# EAGLE design PortaCopos (EAGLE 9.6.2)

## Sheet 1 of 2
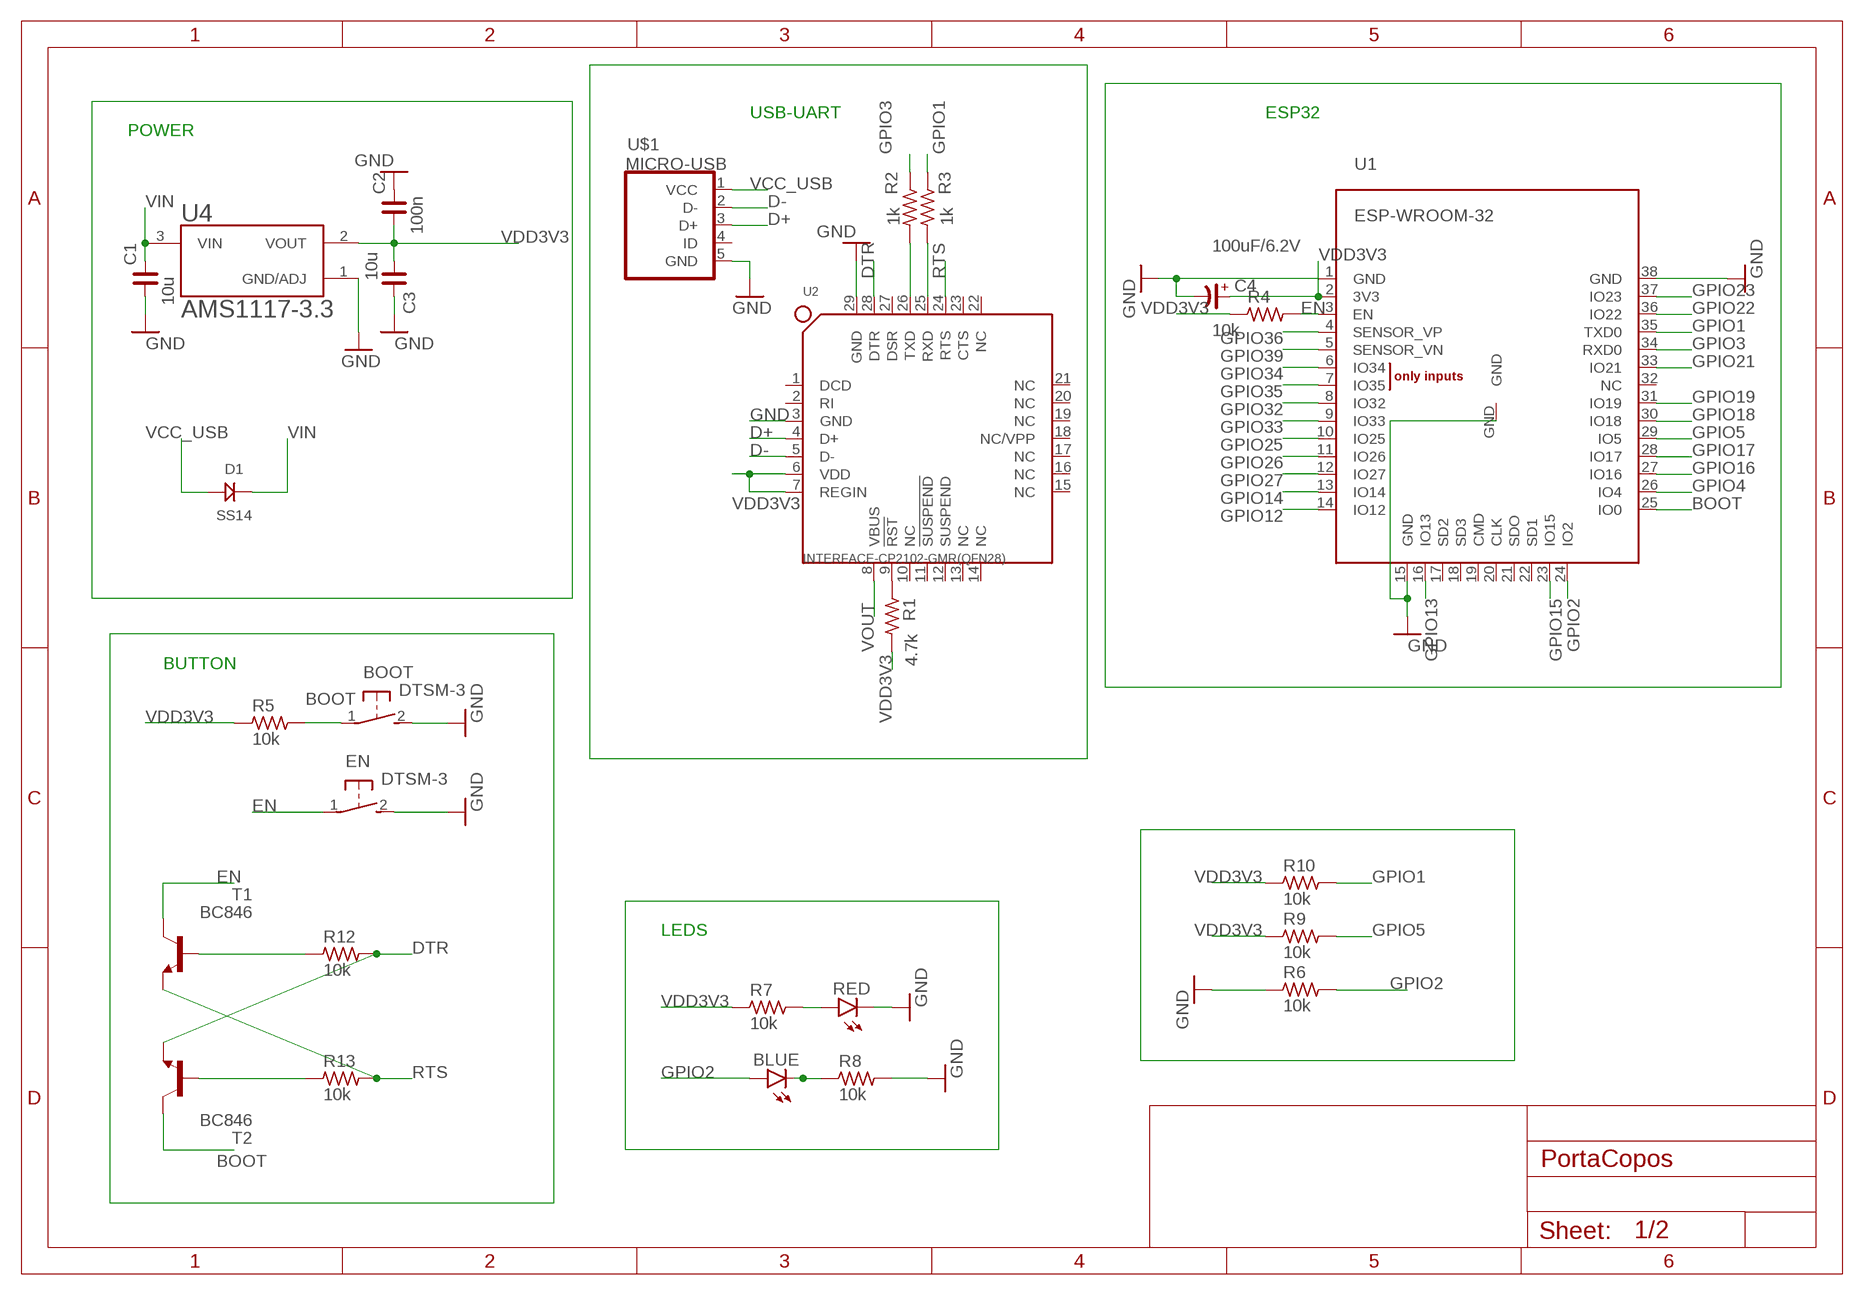
[diagram p0: schematic, sheet 1]

### Parts
BLUE  blue  LEDCHIPLED_0603  [CHIPLED_0603]
BOOT  DTSM-3  [DTSM-3]
C1  10u  C_0603  [C0603]
C2  100n  C_0603  [C0603]
C3  10u  C_0603  [C0603]
C4  100uF/6.2V  CP_3216-18  [C3216-18/T]
D1  SS14  [DO214]
EN  DTSM-3  [DTSM-3]
R1  4.7k  R_0603  [R0603]
R2  1k  R_0603  [R0603]
R3  1k  R_0603  [R0603]
R4  10k  R_0603  [R0603]
R5  10k  R_0603  [R0603]
R6  10k  R_0603  [R0603]
R7  10k  R_0603  [R0603]
R8  10k  R_0603  [R0603]
R9  10k  R_0603  [R0603]
R10  10k  R_0603  [R0603]
R12  10k  R_0603  [R0603]
R13  10k  R_0603  [R0603]
RED  red  LEDCHIPLED_0603  [CHIPLED_0603]
T1  BC846  [SOT23]
T2  BC846  [SOT23]
U1  ESP-WROOM-32  [ESP-WROOM-32]
U2  INTERFACE-CP2102-GMR(QFN28)  [QFN28G_0.5-5X5MM]
U4  AMS1117-3.3  [SOT229P700X180-4N]
U$1  MICRO-USB  [MICRO-USB-2]

### Nets
BOOT: BOOT.1 R5.2 T2.3(C) U1.25(IO0)
D+: U2.4(D+) U$1.3(D+)
D-: U2.5(D-) U$1.2(D-)
DTR: R12.2 T2.2(E) U2.28(DTR)
EN: EN.1 R4.2 T1.3(C) U1.3(EN)
GND: BOOT.2 C1.1 C2.2 C3.2 C4.- EN.2 R6.1 R8.2 RED.C U1.1(GND) U1.15(GND) U1.38(GND) U1.GND U2.3(GND) U2.29(GND) U4.1(GND/ADJ) U$1.5(GND) ; also sheet 2
GPIO1: R3.1 R10.2 U1.35(TXD0)
GPIO2: BLUE.A R6.2 U1.24(IO2)
GPIO3: R2.1 U1.34(RXD0)
GPIO4: U1.26(IO4) ; also sheet 2
GPIO5: R9.2 U1.29(IO5)
GPIO12: U1.14(IO12)
GPIO13: U1.16(IO13)
GPIO14: U1.13(IO14)
GPIO15: U1.23(IO15)
GPIO16: U1.27(IO16) ; also sheet 2
GPIO17: U1.28(IO17)
GPIO18: U1.30(IO18)
GPIO19: U1.31(IO19)
GPIO21: U1.33(IO21)
GPIO22: U1.36(IO22)
GPIO23: U1.37(IO23)
GPIO25: U1.10(IO25)
GPIO26: U1.11(IO26)
GPIO27: U1.12(IO27)
GPIO32: U1.8(IO32)
GPIO33: U1.9(IO33)
GPIO34: U1.6(IO34)
GPIO35: U1.7(IO35)
GPIO36: U1.4(SENSOR_VP)
GPIO39: U1.5(SENSOR_VN)
N$1: R1.1 U2.9(!RST)
N$2: R2.2 U2.26(TXD)
N$3: R3.2 U2.25(RXD)
N$5: R12.1 T1.1(B)
N$6: R13.1 T2.1(B)
N$7: BLUE.C R8.1
N$23: R7.2 RED.A
RTS: R13.2 T1.2(E) U2.24(RTS)
VCC_USB: D1.ANODE U$1.1(VCC)
VDD3V3: C2.1 C3.1 C4.+ R1.2 R4.1 R5.1 R7.1 R9.1 R10.1 U1.2(3V3) U2.6(VDD) U2.7(REGIN) U4.2(VOUT) ; also sheet 2
VIN: C1.2 D1.CATHODE(KATHODE) U4.3(VIN)
VOUT: U2.8(VBUS)
Unconnected: U1.17(SD2) U1.18(SD3) U1.19(CMD) U1.20(CLK) U1.21(SDO) U1.22(SD1) U1.32(NC) U2.1(DCD) U2.2(RI) U2.10(NC) U2.11(!SUSPEND) U2.12(SUSPEND) U2.13(NC) U2.14(NC) U2.15(NC) U2.16(NC) U2.17(NC) U2.18(NC/VPP) U2.19(NC) U2.20(NC) U2.21(NC) U2.22(NC) U2.23(CTS) U2.27(DSR) U$1.4(ID)

### Notes on the sheet
- USB-UART | ESP32
- POWER
- BUTTON
- LEDS

## Sheet 2 of 2
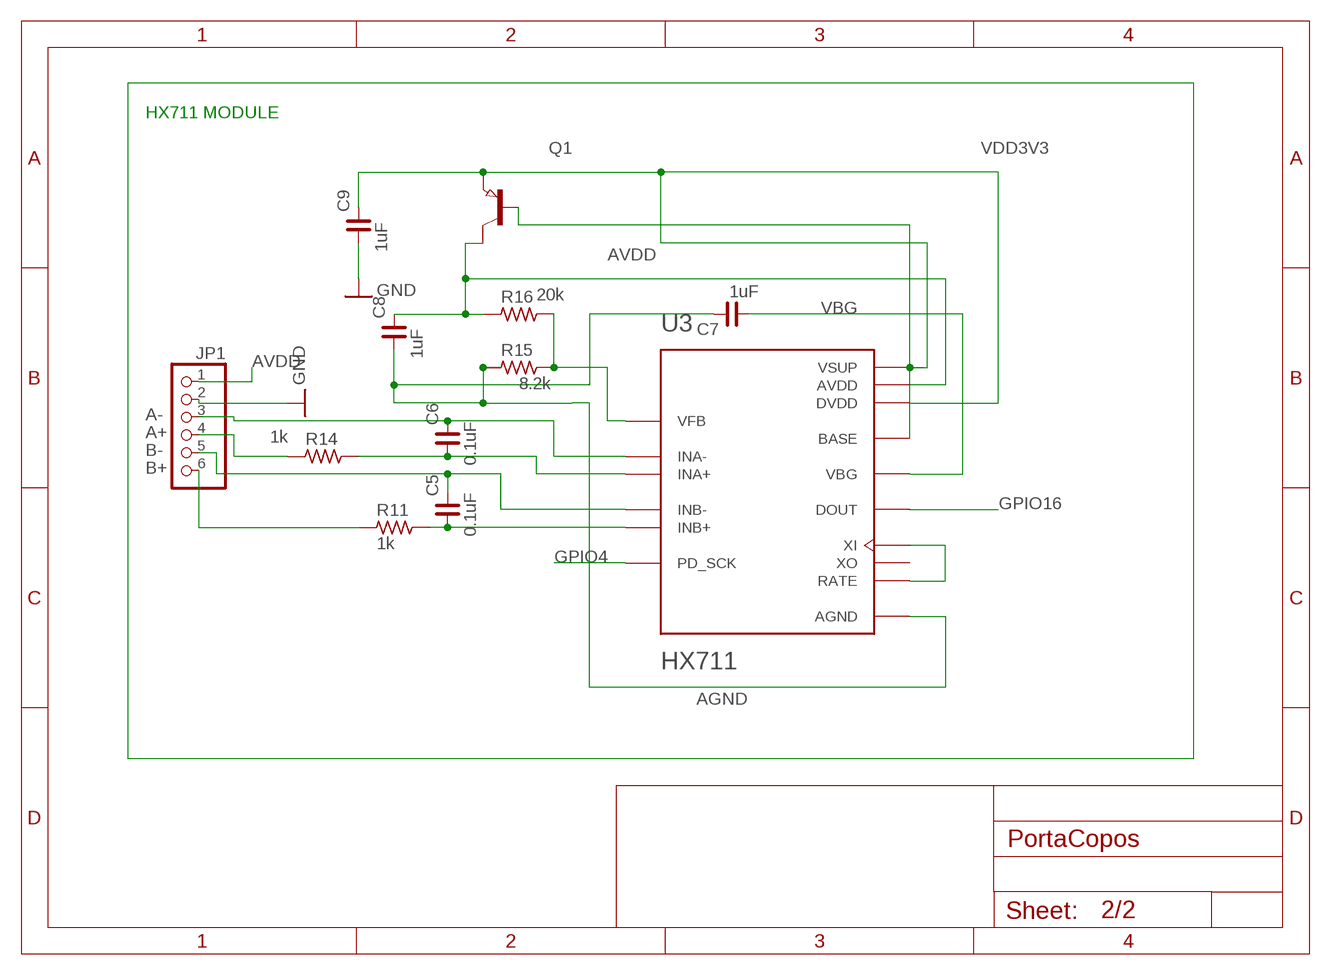
[diagram p1: schematic, sheet 2]

### Parts
C5  0.1uF  C_0805  [C0805]
C6  0.1uF  C_0805  [C0805]
C7  1uF  C_0805  [C0805]
C8  1uF  C_0805  [C0805]
C9  1uF  C_0805  [C0805]
JP1  PINHD-1X6  [1X06]
Q1  PNP-TRANSISTOR_SOT23  [SOT23]
R11  1k  R_0603  [R0603]
R14  1k  R_0603  [R0603]
R15  8.2k  R_0603  [R0603]
R16  20k  R_0603  [R0603]
U3  HX711  [SOP127P600X180-16N]

### Nets
A+: JP1.4 R14.1
A-: C6.2 JP1.3 U3.7(INA-)
AGND: C7.2 C8.1 R15.1 U3.5(AGND)
AVDD: C8.2 JP1.1 Q1.3(C) R16.1 U3.3(AVDD)
B+: JP1.6 R11.1
B-: C5.2 JP1.5 U3.9(INB-)
GND: C9.1 JP1.2 ; also sheet 1
GPIO4: U3.11(PD_SCK) ; also sheet 1
GPIO16: U3.12(DOUT) ; also sheet 1
N$8: U3.14(XI) U3.15(RATE)
N$11: C5.1 R11.2 U3.10(INB+)
N$13: C6.1 R14.2 U3.8(INA+)
N$14: R15.2 R16.2 U3.4(VFB)
VBG: C7.1 U3.6(VBG)
VDD3V3: C9.2 Q1.1(B) Q1.2(E) U3.1(VSUP) U3.2(BASE) U3.16(DVDD) ; also sheet 1
Unconnected: U3.13(XO)

### Notes on the sheet
- HX711 MODULE

## Library data of the parts
BLUE RED = led:LED: LED OSRAM: - CHIPLED LG R971, LG N971, LY N971, LG Q971, LY Q971, LO R971, LY R971 LH N974, LH R974 LS Q976, LO Q976, LY Q976 LO Q996 - Hyper CHIPLED LW Q18S LB Q993, LB Q99A, LB R99A - SideLED LS A670, LO A670, LY A670, LG A670, LP A670 LB A673, LV A673, LT A673, LW A673 LH A674 LY A675 LS A676, LA A676, LO A676, LY A676, LW A676 LS A679, LY A679, LG A679 - Hyper Micro SIDELED® LS Y876, LA Y876, LO Y876, LY Y876 LT Y87S - SmartLED LW L88C, LW L88S LB L89C, LB L89S, LG L890 LS L89K, LO L89K, LY L89K LS L896, LA L896, LO L896, LY L896 - TOPLED LS T670, LO T670, LY T670, LG T670, LP T670 LSG T670, LSP T670, LSY T670, LOP T670, LYG T670 LG T671, LOG T671, LSG T671 LB T673, LV T673, LT T673, LW T673 LH T674 LS T676, LA T676, LO T676, LY T676, LB T676, LH T676, LSB T676, LW T676 LB T67C, LV T67C, LT T67C, LS T67K, LO T67K, LY T67K, LW E67C LS E67B, LA E67B, LO E67B, LY E67B, LB E67C, LV E67C, LT E67C LW T67C LS T679, LY T679, LG T679 LS T770, LO T770, LY T770, LG T770, LP T770 LB T773, LV T773, LT T773, LW T773 LH T774 LS E675, LA E675, LY E675, LS T675 LS T776, LA T776, LO T776, LY T776, LB T776 LHGB T686 LT T68C, LB T68C - Hyper Mini TOPLED® LB M676 - Mini TOPLED Santana® LG M470 LS M47K, LO M47K, LY M47K Source: http://www.osram.convergy.de LUXEON: - LUMILED® LXK2-PW12-R00, LXK2-PW12-S00, LXK2-PW14-U00, LXK2-PW14-V00 LXK2-PM12-R00, LXK2-PM12-S00, LXK2-PM14-U00 LXK2-PE12-Q00, LXK2-PE12-R00, LXK2-PE12-S00, LXK2-PE14-T00, LXK2-PE14-U00 LXK2-PB12-K00, LXK2-PB12-L00, LXK2-PB12-M00, LXK2-PB14-N00, LXK2-PB14-P00, LXK2-PB14-Q00 LXK2-PR12-L00, LXK2-PR12-M00, LXK2-PR14-Q00, LXK2-PR14-R00 LXK2-PD12-Q00, LXK2-PD12-R00, LXK2-PD12-S00 LXK2-PH12-R00, LXK2-PH12-S00 LXK2-PL12-P00, LXK2-PL12-Q00, LXK2-PL12-R00 Source: www.luxeon.com KINGBRIGHT: KA-3528ASYC Source: www.kingbright.com
BOOT EN = switch-tact:DTSM-3
C1-C3 C5-C9 = rc-master-smd:C_: NON-POLARIZED CAP
C4 = rc-master-smd:CP_: POLARIZED CAP
D1 = SS14:SS14: Check prices <https://pricing.snapeda.com/parts/SS14/ON%20Semiconductor/view-part?ref=eda>; AVAILABILITY: In Stock; DESCRIPTION: Diode Schottky 40V 1A Surface Mount DO-214AC (SMA); MF: ON Semiconductor; MP: SS14; PACKAGE: SMA-2 ON Semiconductor; PRICE: None; PURCHASE-URL: https://pricing.snapeda.com/search/part/SS14/?ref=eda
JP1 = pinhead:PINHD-1X6: PIN HEADER
Q1 = semicon-smd-ipc:PNP-TRANSISTOR_: PNP TRANSISTOR
R1-R16 = rc-master-smd:R_: RESISTOR
T1 T2 = transistor-neu-to92:BC846: NPN TRANSISTOR
U1 = esp32:ESP-WROOM-32
U2 = CP2102-GMR_QFN28_:INTERFACE-CP2102-GMR(QFN28): 310070003 Check prices <https://pricing.snapeda.com/parts/CP2102-GMR/Silicon/view-part?ref=eda>; AVAILABILITY: In Stock; DESCRIPTION: USB Bridge, USB to UART USB 2.0 UART Interface 28-QFN (5x5); MF: Silicon; MP: CP2102-GMR; PACKAGE: VFQFN-28 Vishay Siliconix; PRICE: None; PURCHASE-URL: https://pricing.snapeda.com/search/part/CP2102-GMR/?ref=eda
U3 = HX711:HX711: Check availability <https://pricing.snapeda.com/parts/HX711/AVIA%20SEMICONDUCTOR/view-part?ref=eda>; AVAILABILITY: Not in stock; CHECK_PRICES: https://www.snapeda.com/parts/HX711/AVIA+SEMICONDUCTOR/view-part/?ref=eda; DESCRIPTION: Precision 24-bit analog-to-digital converter (ADC) designed for weigh scales and industrial control applications to interface directly with a bridge sensor.; MF: AVIA SEMICONDUCTOR; MP: HX711; PACKAGE: None; PRICE: None; SNAPEDA_LINK: https://www.snapeda.com/parts/HX711/AVIA+SEMICONDUCTOR/view-part/?ref=snap
U4 = AMS1117-3.3:AMS1117-3.3: Check availability <https://pricing.snapeda.com/parts/AMS1117-3.3/Advanced%20Monolithic%20Systems/view-part?ref=eda>; AVAILABILITY: Not in stock; CHECK_PRICES: https://www.snapeda.com/parts/AMS1117-3.3/Advanced+Monolithic+Systems/view-part/?ref=eda; DESCRIPTION: Sot223/Pkg 1-Amp 3.3-Volt Low Drop Out Voltage Regulatator; MF: Advanced Monolithic Systems; MP: AMS1117-3.3; PACKAGE: SOT-223 Seeed Technology; PRICE: None; SNAPEDA_LINK: https://www.snapeda.com/parts/AMS1117-3.3/Advanced+Monolithic+Systems/view-part/?ref=snap
U$1 = SX1308:MICRO-USB

## Board
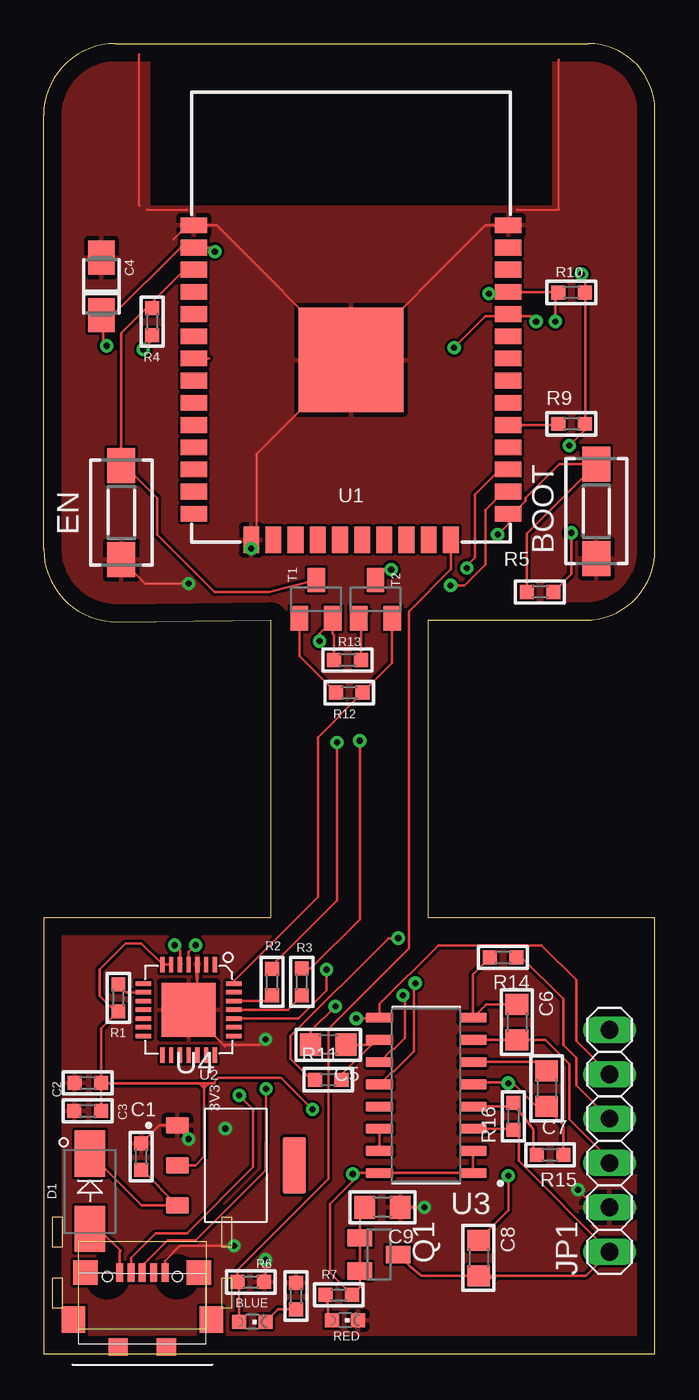
[diagram p2: board, top side]
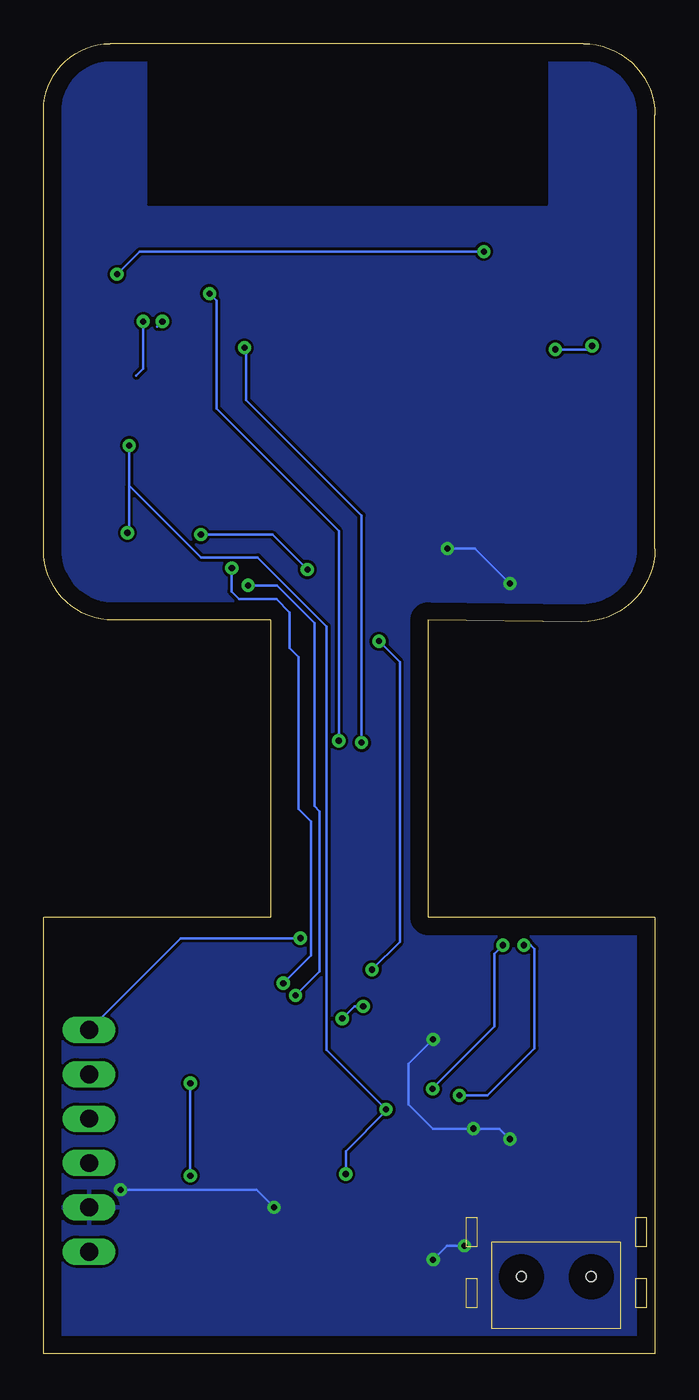
[diagram p3: board, bottom side, seen from below]

Size 35 x 75 mm. Coordinates in mm from the lower left corner, seen from the top.
Outline: 0,0 35,0 35,25 22,25 22,42 31,42 arc90 35,46 35,71.2 arc90 31.2,75 4.1,75 arc90 0,70.9 0,46.1 arc90 4.2,41.9 13,42 13,25 0,25 0,0
Copper layers (1*16): Top 0.035mm / dielectric 1.5mm / Bottom 0.035mm
Design rules "default": minimum track width 6mil, minimum drill 0.35mm, track to track 6mil, track to pad 6mil, pad to pad 6mil, via to via 6mil, smd to smd 6mil, copper to edge 40mil, drill to drill 6mil, minimum pad ring 10mil, minimum via ring 8mil, stop-mask expansion 4mil, vias tented up to drill 0mil, thermal gap 10mil

### Footprints (pad centres in the part's own frame; a part is rotated, then mirrored left to right if it is on the bottom)
CHIPLED_0603 = smd 0.8 x 0.8: A 0,-0.75; C 0,0.75
DTSM-3 = smd 2 x 1.6: 1 -2.7,0; 2 2.7,0
C0603 = smd 0.8 x 0.8: 1 -0.762,0; 2 0.762,0
C3216-18/T = smd 1.95 x 1.5: + 1.651,0; - -1.651,0
C0805 = smd 1.2 x 1.3: 1 -1.016,0; 2 1.016,0
DO214 = smd 2.65 x 1.75: ANODE -2.15,0; CATHODE 2.15,0
1X06 = drill 1.016 long: 1 -6.35,0; 2 -3.81,0; 3 -1.27,0; 4 1.27,0; 5 3.81,0; 6 6.35,0
SOT23 = smd 1 x 1.4: 1 -0.95,-1.1; 2 0.95,-1.1; 3 0,1.1
R0603 = smd 0.8 x 0.8: 1 -0.762,0; 2 0.762,0
ESP-WROOM-32 = smd 0.9 x 1.5: 1 7.7,9; 2 6.43,9; 3 5.16,9; 4 3.89,9; 5 2.62,9; 6 1.35,9; 7 0.08,9; 8 -1.19,9; 9 -2.46,9; 10 -3.73,9; 11 -5,9; 12 -6.27,9; 13 -7.54,9; 14 -8.81,9; 25 -8.81,-9; 26 -7.54,-9; 27 -6.27,-9; 28 -5,-9; 29 -3.73,-9; 30 -2.46,-9; 31 -1.19,-9; 32 0.08,-9; 33 1.35,-9; 34 2.62,-9; 35 3.89,-9; 36 5.16,-9; 37 6.43,-9; 38 7.7,-9 | smd 1.5 x 0.9: 15 -10.3,5.715; 16 -10.3,4.445; 17 -10.3,3.175; 18 -10.3,1.905; 19 -10.3,0.635; 20 -10.3,-0.635; 21 -10.3,-1.905; 22 -10.3,-3.175; 23 -10.3,-4.445; 24 -10.3,-5.715 | smd 6 x 6: GND 0,0
QFN28G_0.5-5X5MM = smd 0.9 x 0.254: 1 -2.59,1.5; 2 -2.59,1; 3 -2.59,0.5; 4 -2.59,0; 5 -2.59,-0.5; 6 -2.59,-1; 7 -2.59,-1.5; 15 2.59,-1.5; 16 2.59,-1; 17 2.59,-0.5; 18 2.59,0; 19 2.59,0.5; 20 2.59,1; 21 2.59,1.5 | smd 0.254 x 0.9: 8 -1.5,-2.59; 9 -1,-2.59; 10 -0.5,-2.59; 11 0,-2.59; 12 0.5,-2.59; 13 1,-2.59; 14 1.5,-2.59; 22 1.5,2.59; 23 1,2.59; 24 0.5,2.59; 25 0,2.59; 26 -0.5,2.59; 27 -1,2.59; 28 -1.5,2.59 | smd 3.1 x 3.1: 29 0,0
SOP127P600X180-16N = smd 1.58 x 0.59: 1 -2.67,4.445; 2 -2.67,3.175; 3 -2.67,1.905; 4 -2.67,0.635; 5 -2.67,-0.635; 6 -2.67,-1.905; 7 -2.67,-3.175; 8 -2.67,-4.445; 9 2.67,-4.445; 10 2.67,-3.175; 11 2.67,-1.905; 12 2.67,-0.635; 13 2.67,0.635; 14 2.67,1.905; 15 2.67,3.175; 16 2.67,4.445
SOT229P700X180-4N = smd 1.31 x 0.93: 1 -3.345,2.29; 2 -3.345,0; 3 -3.345,-2.29 | smd 1.31 x 3.24: 4 3.345,0
MICRO-USB-2 = smd 1.4 x 1.4: 0 -3.25,2.735; 0.5 3.25,2.735 | smd 1.35 x 1.5: 0.1 -3.95,0.035; 0.4 3.95,0.035 | smd 1.1 x 1: 0.2 -1.38,-1.54; 0.3 1.38,-1.54 | smd 0.4 x 1.05: 1 -1.3,2.735; 2 -0.65,2.735; 3 0,2.735; 4 0.65,2.735; 5 1.3,2.735 | hole 0.55: -2,2.49; 2,2.49

### Placement (x,y rotation side)
BLUE  11.95,1.83 270 top
BOOT  31.65,48.24 270 top
C1  5.58,11.3 270 top
C2  2.53,15.52 180 top
C3  2.52,13.92 180 top
C4  3.31,61.11 270 top
C5  16.3,17.7 180 top
C6  27.1,19 270 top
C7  28.8,15.2 270 top
C8  24.9,5.5 270 top
C9  19.4,8.4 180 top
D1  2.65,9.32 90 top
EN  4.45,48.16 270 top
JP1  32.4,12.2 90 top
Q1  19.2,5.7 270 top
R1  4.28,20.38 270 top
R2  13.08,21.29 270 top
R3  14.78,21.3 270 top
R4  6.22,59.09 90 top
R5  28.42,43.62 180 top
R6  11.86,4.12 180 top
R7  16.9,3.38 180 top
R8  14.45,3.32 90 top
R9  30.22,53.24 180 top
R10  30.22,60.76 180 top
R11  16.3,15.7 0 top
R12  17.5,37.85 0 top
R13  17.4,39.72 180 top
R14  26.3,22.7 180 top
R15  29,11.4 180 top
R16  26.9,13.6 90 top
RED  17.25,1.93 270 top
T1  15.6,43.2 0 top
T2  19,43.2 0 top
U1  17.6,56.9 90 top
U2  8.3,19.7 270 top
U3  21.9,14.8 180 top
U4  11,10.8 0 top
U$1  5.65,1.94 0 top

### Tracks (layer width: path | path; a pad name or v marks a point on that pad's centre or on a via)
A+
  Top 0.152: R14.1 27.36,22.7 29.75,20.32 29.75,17.7 30.5,16.95 30.5,15.37 JP1.4
A-
  Top 0.152: JP1.3 32.4,11.13 30.1,13.43 30.1,16.6 28.73,17.98 C6.2 | U3.7 25.2,17.98 C6.2 | C6.2
AGND  (via drill 0.35)
  Top 0.152: C8.1 26.6,8.22 v26.6,10.2 | U3.5 24.67,15.54 26.43,15.54 26.47,15.5 v26.6,15.5 26.89,15.5 28.2,14.18 C7.2 28.9,14.18 28.9,13.96 29.76,13.1 R15.1
  Bottom 0.152: v26.6,15.5 v26.6,10.2
AVDD
  Top 0.152: C8.2 21.64,4.48 20.98,5.02 Q1.3 | U3.3 26.84,12.89 R16.1 27.2,12.54 27.2,11.05 JP1.1 31.03,4.48 C8.2 | 25.84,4.36 25.08,4.31 C8.2
B+  (via drill 0.35)
  Top 0.152: v20.3,23.8 19.74,23.8 14.14,18.2 14.14,16.9 15.34,15.7 R11.1
  Bottom 0.152: v20.3,23.8 27.15,23.8 JP1.6
B-  (via drill 0.35)
  Top 0.152: JP1.5 30.5,17.91 30.5,21.4 28.5,23.4 22.6,23.4 19.23,20.03 U3.9 19.18,19.2 v17.9,19.2 | C5.2 15.28,18.48 v16.7,19.9
  Bottom 0.152: v16.7,19.9 17.2,19.9 v17.9,19.2
BOOT  (via drill 0.35)
  Top 0.152: 19.09,44.4 T2.3 19.6,44.9 v19.9,44.9 | BOOT.1 | BOOT.1 27.66,46.96 R5.2 | BOOT.1 29.54,50.94 27.58,48.98 27.58,48.81 26.85,48.09 U1.25 26.6,47.5 v26,46.9
  Bottom 0.152: v19.9,44.9 21.9,46.9 v26,46.9
D+  (via drill 0.35)
  Top 0.152: U$1.3 5.65,5.07 6,5.42 6.02,5.42 7.1,6.5 8.7,6.5 12.7,10.5 12.7,12.1 12.73,12.13 v12.73,15.17 | v8.7,23.4 8.3,23 U2.4
  Bottom 0.152: v12.73,15.17 12.73,15.21 9.2,18.74 9.2,22.9 v8.7,23.4
D-  (via drill 0.35)
  Top 0.152: 7.89,22.29 U2.5 7.8,23.1 v7.5,23.4 | U$1.2 5,5.5 6.4,6.9 8.2,6.9 12,10.7 12,14 v11.2,14.8
  Bottom 0.152: v11.2,14.8 9.6,14.8 6.9,17.5 6.9,23.2 7.1,23.4 v7.5,23.4
DTR
  Top 0.152: U2.28 10.89,21.34 15.7,26.16 15.7,35.29 R12.2 19.95,39.54 T2.2
EN
  Top 0.152: R4.2 6.22,60.2 | 6.22,60.2 6.22,60.22 8.06,62.06 U1.3 | T1.3 12.92,43.6 9.8,43.6 6.5,46.9 6.5,49 4.64,50.86 EN.1 4.45,58.43 6.22,60.2
GND  (via drill 0.35)
  Top 0.127: 27.1,65.5 29.5,65.5 29.5,74.11 | 5.9,65.51 8.2,65.51 | 5.47,65.7 5.47,74.41
  Top 0.152: U1.GND 12.2,51.49 12.2,46.91 U1.15 v11.88,46.1 | 7.44,63.8 8.23,64.6 U1.1 9.9,64.6 U1.GND | U1.GND 25.3,64.6 U1.38 26.9,64.6 | C1.1 6.61,13.09 U4.1 7.66,12.95 v8.3,12.3 | 10.4,17.6 10.3,17.7 | 10.3,17.7 U2.29 8.8,20.2 U2.3 | JP1.2 31.61,8.39 v30.6,9.4 | v21.8,8.4 C9.1 | 10.3,17.7 12.4,17.7 v12.7,18 | EN.2 5.81,44.1 v8.3,44.1 | U$1.5 6.95,5.35 7.79,6.2 8.83,6.2 v10.9,6.2 | v12.7,5.4 12.7,4.2 R6.1
  Bottom 0.152: v8.3,12.3 8.9,12.9 v10.4,12.9 12.7,12.9 14.1,14.3 14.1,16.6 v12.7,18 | v30.6,9.4 22.8,9.4 v21.8,8.4 | v8.3,44.1 10.3,46.1 v11.88,46.1 | v10.9,6.2 11.9,6.2 v12.7,5.4
  pour Top (rank 4): -0.2,77.5 36.9,77.5 36.9,-0.7 -0.2,-0.7
  pour Bottom: -0.1,76.6 -0.1,-0.3 36.4,-0.3 36.4,76.6
GPIO1  (via drill 0.35)
  Top 0.152: v29.3,59.1 29.3,60.7 29.4,60.8 29.43,60.79 R10.2 29.07,60.79 U1.35 25.59,60.79 v25.5,60.7 | R3.1 15.28,22.06 18.1,24.88 v18.1,35.1
  Bottom 0.152: v29.3,59.1 29.3,56.4 29.7,56 | v18.1,35.1 18.1,47.1 25.1,54.1 25.1,60.3 v25.5,60.7
GPIO2
  Top 0.152: BLUE.A 11.2,4.02 R6.2 11.1,4.82 16.3,10.02 16.3,18.6 20.91,23.21 20.91,42.51 23.32,44.91 U1.24
GPIO3  (via drill 0.35)
  Top 0.152: v28.2,59.1 27.9,59.4 26.72,59.4 | 26.72,59.4 U1.34 | R2.1 13.08,22.23 16.8,25.95 v16.8,35 | v23.5,57.6 25.3,59.4 26.72,59.4
  Bottom 0.152: 28.5,58.8 v28.2,59.1 | v16.8,35 16.8,48 23.4,54.6 23.4,57.5 v23.5,57.6
GPIO4  (via drill 0.35)
  Top 0.152: U1.26 26.51,49.27 26.25,49.27 25.3,48.31 25.3,45.2 24.09,43.99 v23.3,43.99 | U3.11 19.98,17.45 20.07,17.45 20.7,18.08 20.7,20.6 20.66,20.6 v20.58,20.52
  Bottom 0.152: v20.58,20.52 19.19,21.91 19.19,31.05 19.5,31.36 19.5,41.84 21.65,43.99 v23.3,43.99
GPIO5
  Top 0.152: U1.29 26.8,53.17 | 26.8,53.17 29.12,53.17 R9.2 | 26.43,52.8 26.8,53.17
GPIO14
  Top 0.152: 8.04,49.36 U1.13
GPIO15
  Top 0.152: 22.05,46.35 U1.23
GPIO16  (via drill 0.35)
  Top 0.152: U1.27 26.53,50.7 26.2,50.7 24.7,49.2 24.7,45.6 24.23,45.13 v24.23,44.98 | U3.12 19.98,16.18 20.07,16.18 21.2,17.31 21.2,21.3 v21.28,21.22
  Bottom 0.152: v21.28,21.22 19.69,22.81 19.69,30.49 20.4,31.2 20.4,39.9 20.91,40.41 20.91,42.45 21.66,43.2 23.8,43.2 24.25,43.65 24.23,43.67 v24.23,44.98
GPIO17
  Top 0.152: 26.3,52.2 U1.28
GPIO19
  Top 0.152: U1.31
GPIO25
  Top 0.152: 8.63,53.2 U1.10 8.57,53.2
GPIO27
  Top 0.152: 8.17,50.93 8.1,50.93 8.4,50.63 U1.12
GPIO35
  Top 0.152: 8.38,56.98 U1.7 9.46,56.98
N$1
  Top 0.152: U2.9 4.72,20.7 R1.1
N$2
  Top 0.152: U2.26 12.75,20.2 R2.2
N$3
  Top 0.152: R3.2 14.72,20.2 14.49,20.2 13.99,19.7 U2.25
N$5
  Top 0.152: R12.1 14.65,39.94 T1.1
N$6
  Top 0.152: 18.61,42.52 T2.1 18.16,41.99 R13.1
N$7
  Top 0.152: BLUE.C 13.43,2.56 R8.1
N$8
  Top 0.152: U3.15 U3.14
N$11
  Top 0.152: 18.76,17.7 19.04,17.98 U3.10 | 18.76,17.7 17.06,16 R11.2 | C5.1 18.76,17.7
N$13
  Top 0.152: R14.2 24.57,21.73 U3.8 25.34,20.02 C6.1
N$14
  Top 0.152: U3.4 26.7,14.16 R16.2 26.9,14.32 28.04,12.87 28.04,11.6 R15.2
N$23
  Top 0.152: RED.A 16.3,2.13 16.3,2.88 16.14,3.03 R7.2
RTS  (via drill 0.35)
  Top 0.152: 11.3,19.2 U2.24 14.6,19.2 16.2,20.8 v16.2,22 | R13.2 16.64,41.16 16.55,41.25 16.55,42 | 16.55,42 T1.2 | v15.8,40.8 15.8,41.25 16.55,42
  Bottom 0.152: v16.2,22 14.6,23.6 14.6,39.6 v15.8,40.8
VBG
  Top 0.152: C7.1 28.3,16.72 25.16,16.72 25.15,16.7 U3.6
VCC_USB
  Top 0.152: U$1.1 4.35,5.85 4.4,5.9 3.13,7.17 D1.ANODE
VDD3V3  (via drill 0.35)
  Top 0.152: U1.2 8.31,63.33 8.12,63.15 | R10.1 31.03,60.72 | 31.03,60.72 31.03,53.28 R9.1 30.98,52.88 v30.1,52 | C4.+ 3.4,59.46 | 3.4,59.46 3.96,59.46 7.83,63.33 U1.2 | U4.2 8.7,10.8 9.2,11.3 9.2,15.2 | C3.1 3.29,13.93 C2.1 | C2.1 3.31,15.5 8.9,15.5 | 8.9,15.5 9.1,15.5 | 9.2,15.2 9.2,15.4 | 9.1,15.5 9.2,15.4 | 9.1,15.5 9.3,15.5 | 9.3,15.5 9.5,15.5 | 9.5,15.5 9.7,15.5 | 9.7,15.5 9.8,15.5 | 8.9,15.5 9.2,15.2 | 9.2,15.2 9.5,15.5 | 9.2,15.4 9.3,15.5 | C2.1 3.29,18.63 R1.2 4.08,19.62 3.2,20.5 3.2,22 4.7,23.5 5.59,23.5 U2.7 U2.6 | 9.7,15.5 10,15.8 13.6,15.8 v15.39,14.01 v15.39,14 | U3.2 U3.1 U3.16 17.64,10.36 v17.7,10.3 17.7,9.9 16.4,8.6 16.4,4.64 R7.1 18.1,3.82 Q1.2 Q1.1 18.1,8.12 C9.2 | R4.1 6.22,58.02 v5.7,57.5 | v3.6,57.7 3.4,57.9 3.4,59.46 | U1.2 9.57,63.33 v9.8,63.1 | v30.8,61.8 31.03,61.57 31.03,60.72 | R5.1 30.21,44.65 v30.21,47
  Bottom 0.152: v17.7,10.3 17.7,11.6 15.39,13.91 v15.39,14 v15.4,14 18.8,17.4 18.8,41.65 22.75,45.59 25.99,45.59 30.1,49.7 | v30.1,52 30.1,49.7 | v5.7,57.5 3.8,57.5 v3.6,57.7 | v9.8,63.1 29.5,63.1 v30.8,61.8 | v30.21,47 30.1,47.11 30.1,49.7
VIN
  Top 0.152: D1.CATHODE 5.61,8.51 U4.3 5.63,10.53 C1.2

### Text on the board
tNames: 3V3